# EAGLE board Inferno v1 (EAGLE 5.10), part 1 of 3
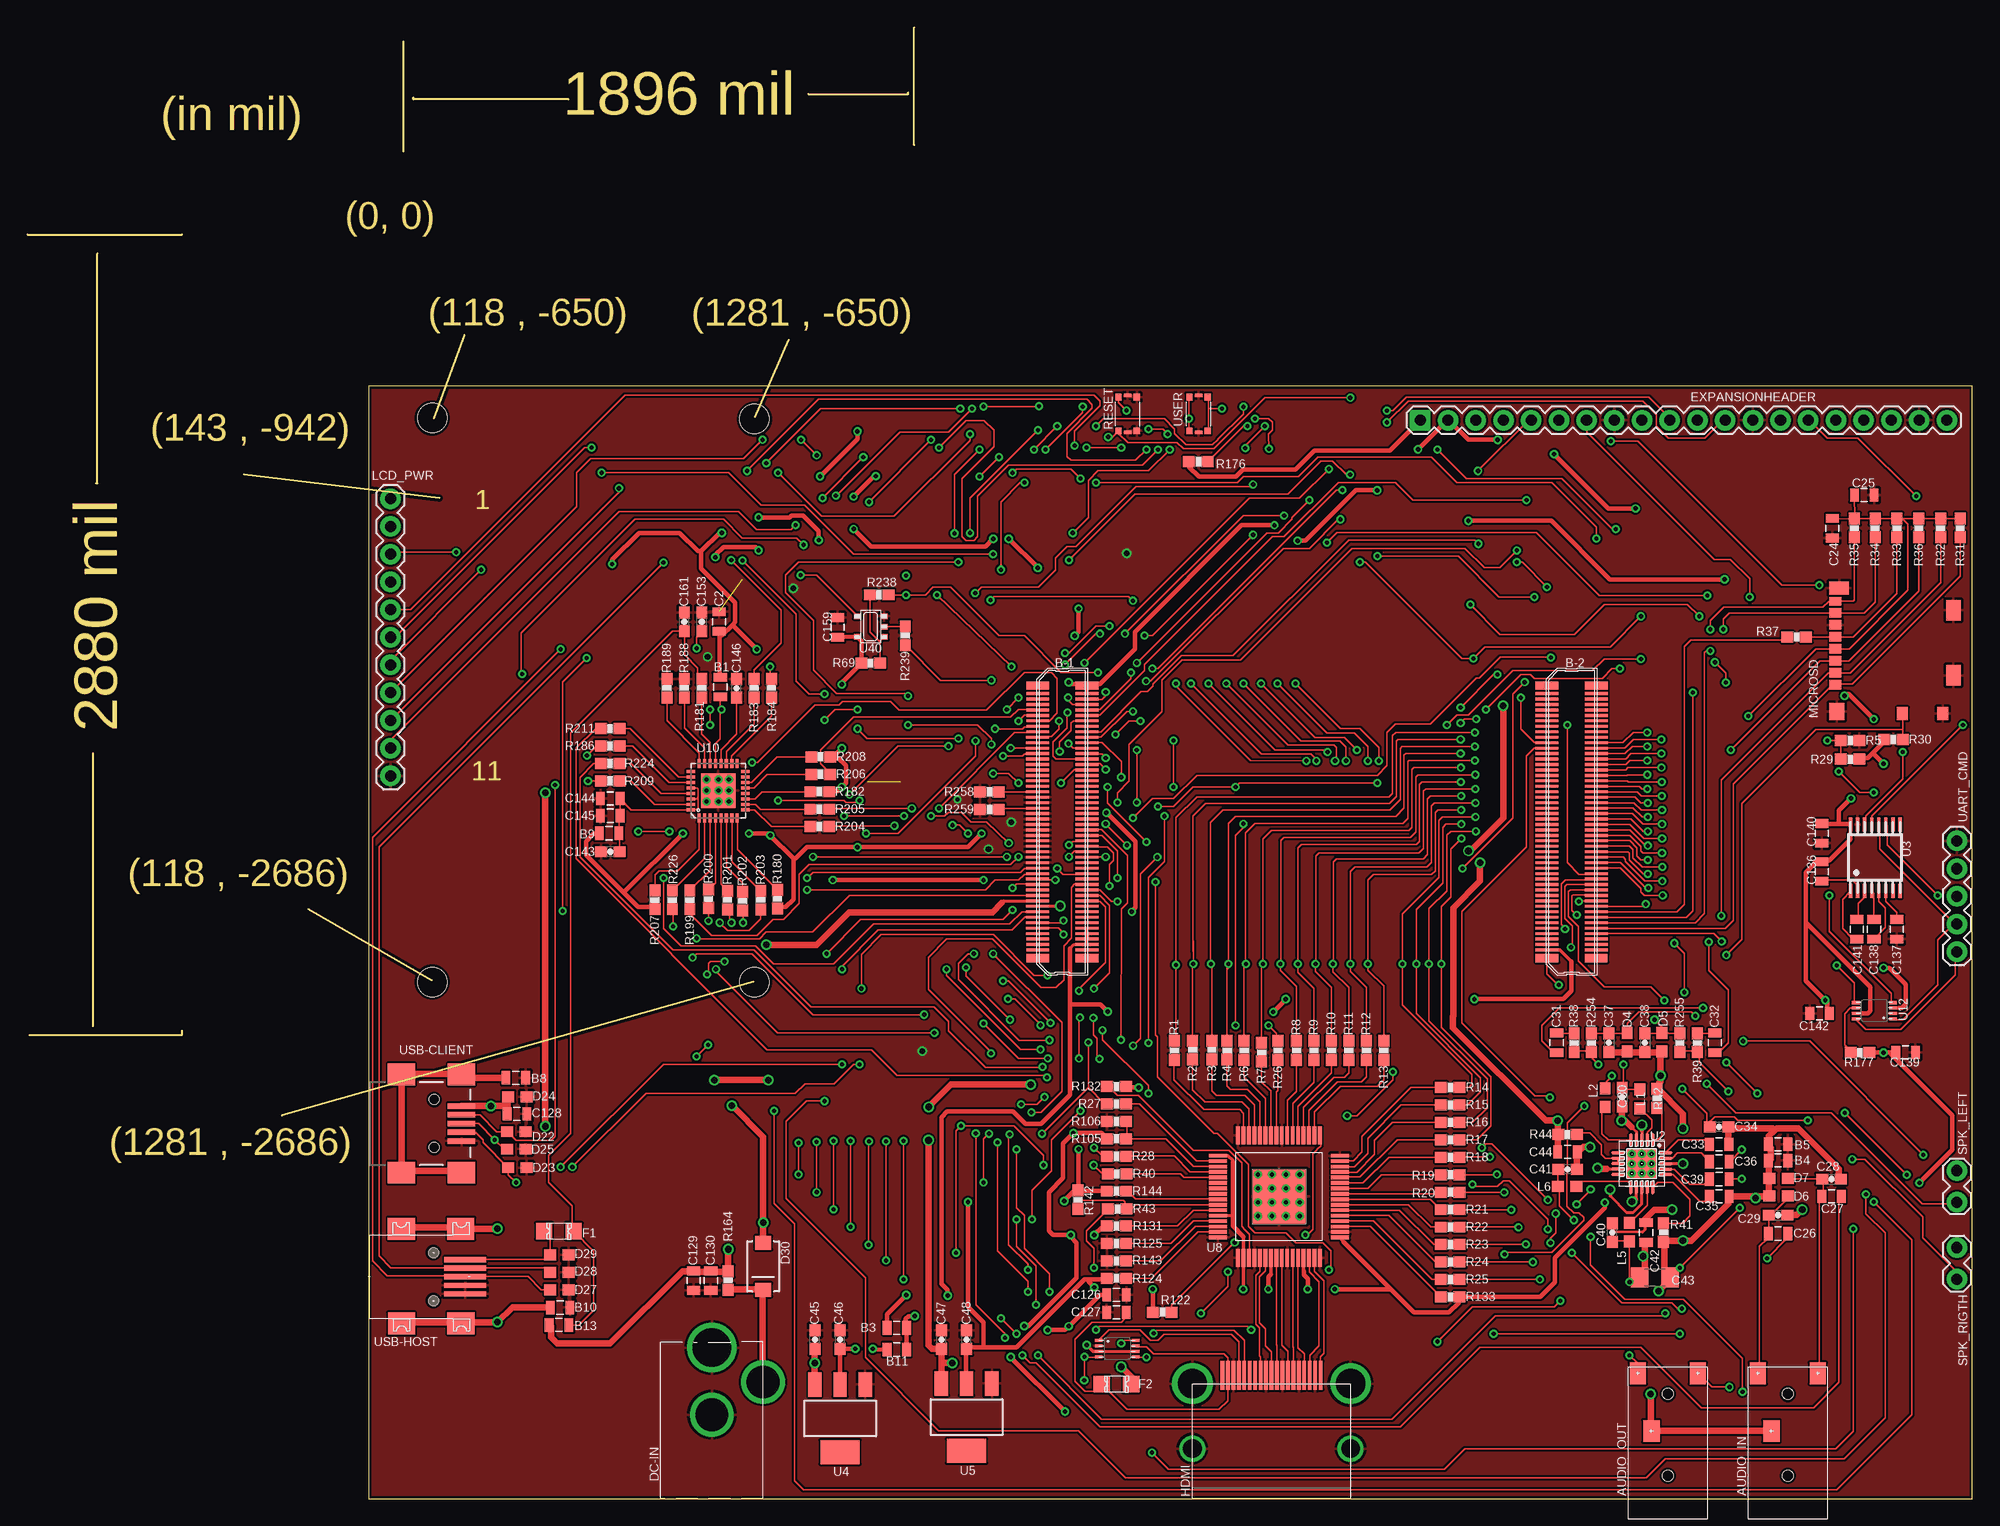
[diagram p7: board, top side]
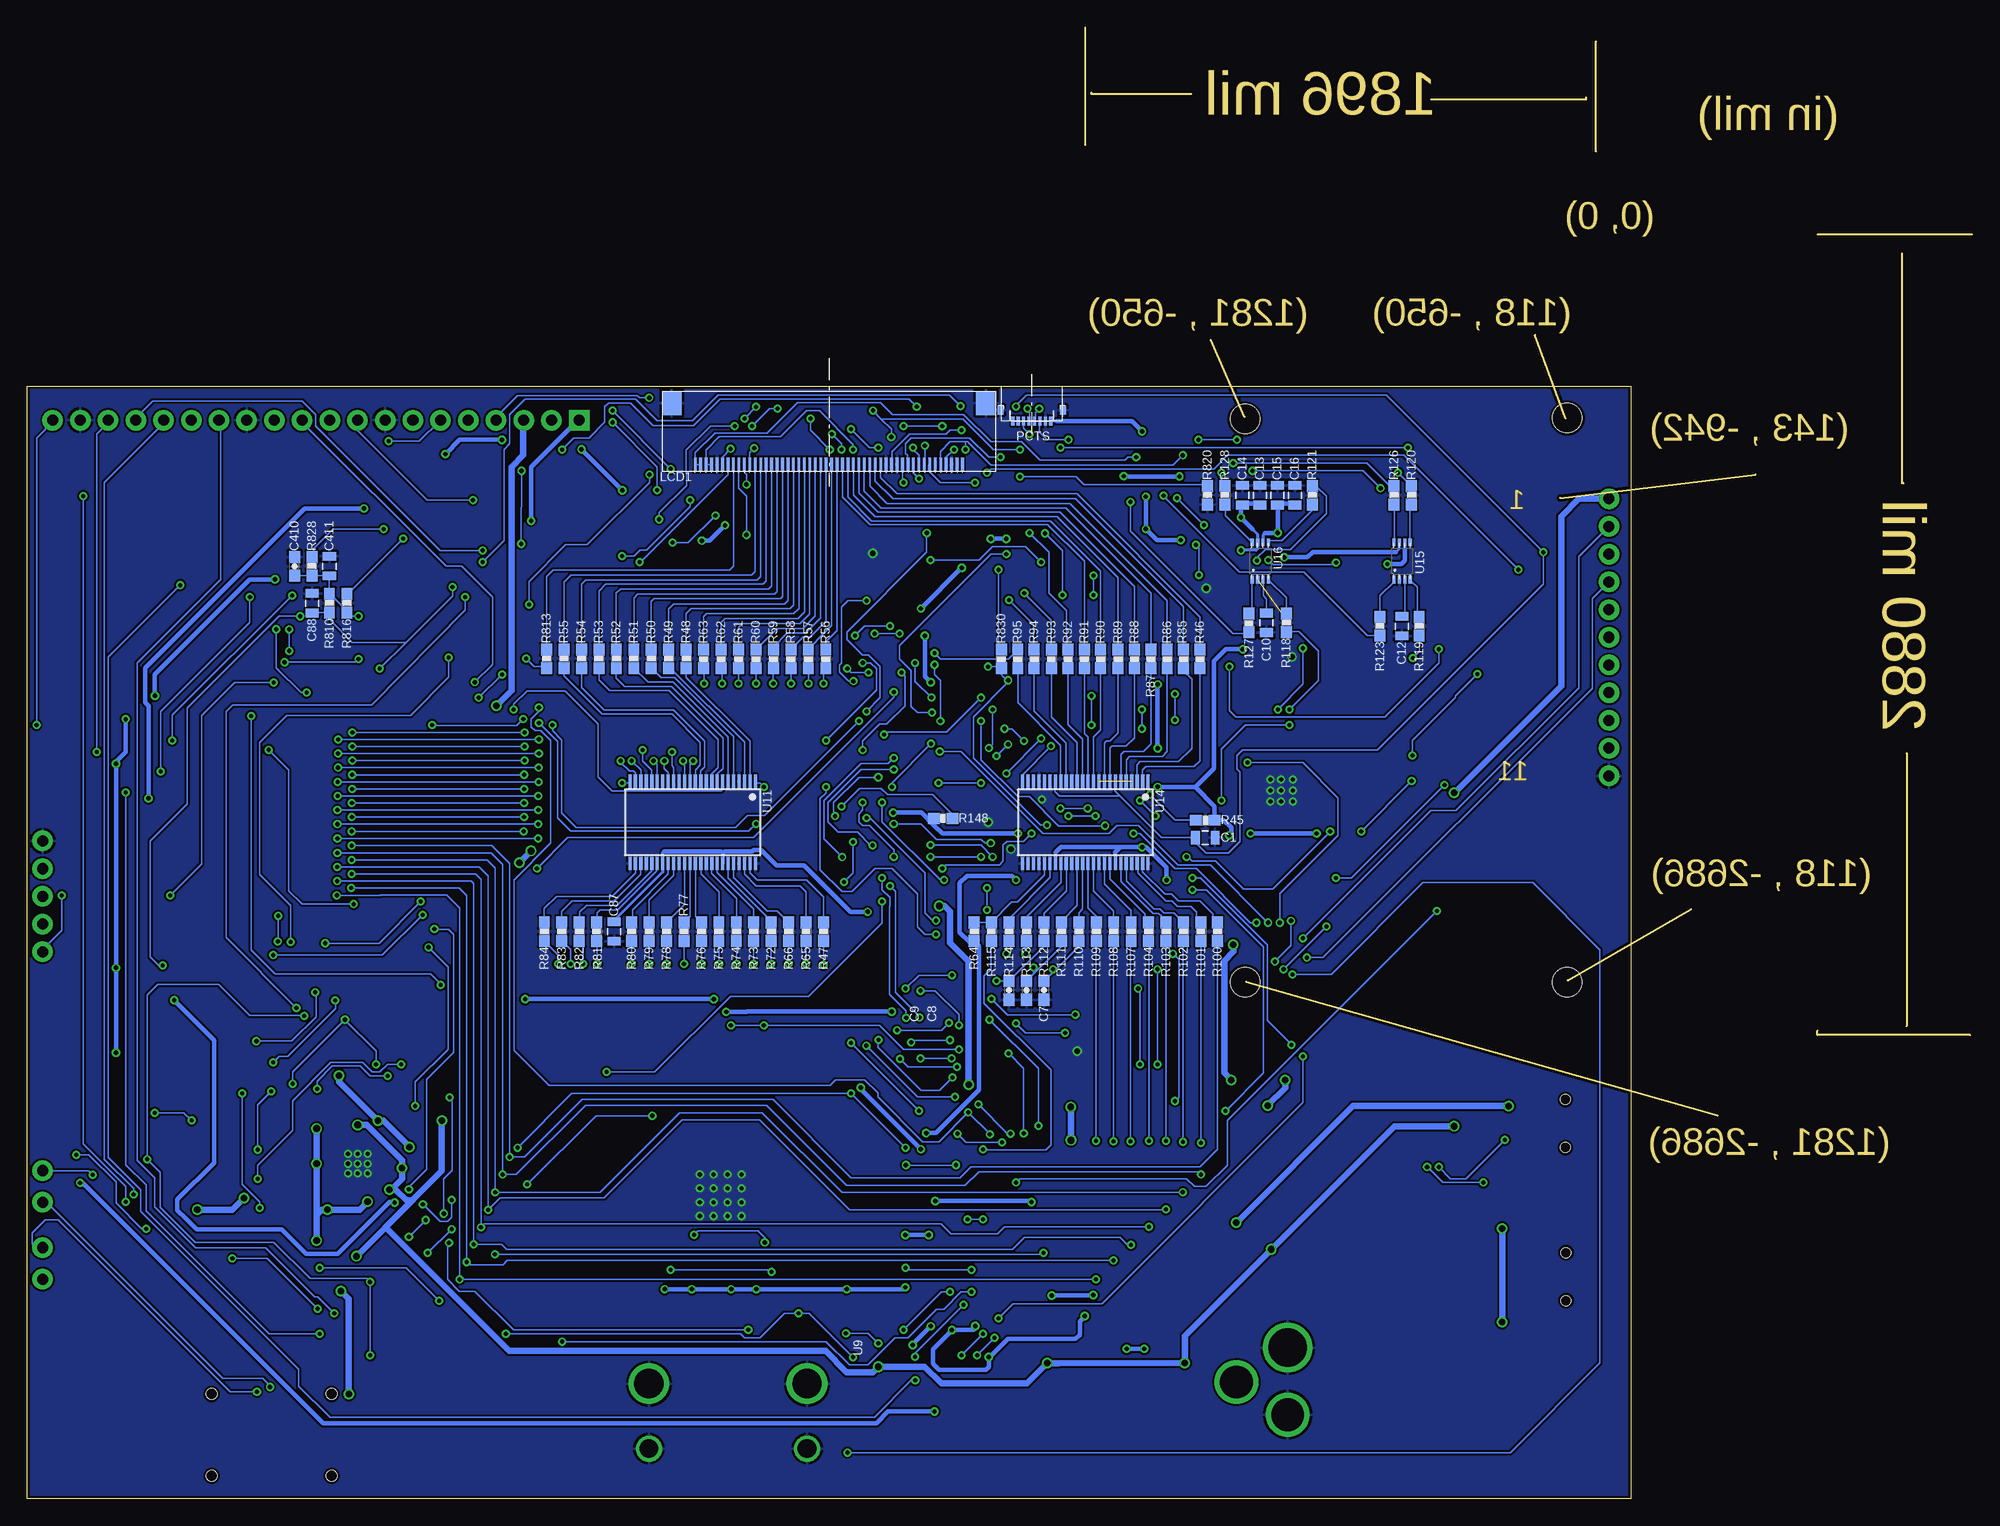
[diagram p8: board, bottom side, seen from below]

Size 178.3 x 134.9 mm. Coordinates in mm from the lower left corner, seen from the top.
Outline: 0.2,42.5 14.2,42.5 14.2,42.9
Outline: 0,115.9 14.2,115.9
Outline: 34.5,123.5 34.5,133.6
Outline: 81.3,124.1 81.3,134.9
Outline: 71.61,128.78 80.75,128.78 80.75,128.93
Outline: 49.61,128.29 35.39,128.29 35.39,128.45
Outline: 6.28,93.09 6.43,93.09 6.43,114.15
Outline: 6,68.35 6,43.33
Outline: 37.29,99.06 40.09,106.68
Outline: 66.71,99.16 69.81,106.22
Outline: 37.09,47.52 25.79,54.03
Outline: 66.56,47.4 23.32,35.13
Outline: 37.78,91.75 19.84,93.9
Outline: 31.3,0 178.3,0 178.3,102 31.3,102 31.3,0
Copper layers (1*16): Top 0.035mm / dielectric 1.5mm / Bottom 0.035mm
Design rules "alteio_4pcb.com_2010_2drc": minimum track width 6mil, minimum drill 15mil, track to track 7mil, track to pad 7mil, pad to pad 7mil, via to via 7mil, smd to smd 7mil, copper to edge 10mil, drill to drill 7mil, minimum pad ring 7mil, minimum via ring 7mil, stop-mask expansion 3mil, vias tented up to drill 0mil, thermal gap 10mil
Net classes: 0 net_DATA: width 0.152 mm, drill 0.381 mm; 1 net_DC_5V: width 0.61 mm, drill 0.61 mm; 2 net_MAIN_DC: width 0.61 mm, drill 0.61 mm; 3 net_VIO_1V8: width 0.406 mm, drill 0.406 mm; 4 net_+3.3V: width 0.406 mm, drill 0.406 mm; 5 net_GND: width 0.61 mm, drill 0.508 mm; 6 net_A_GND: width 0.61 mm, drill 0.508 mm; 7 net_USBC1_GND: width 0.61 mm, drill 0.508 mm

## Footprints (pad centres in the part's own frame; a part is rotated, then mirrored left to right if it is on the bottom)
AUDIO-JACK = smd 2 x 1.5: 1 0.963,1.405; 2 6.263,-2.845; 3 6.263,2.655 | hole 1: -3.137,-0.095; 4.363,-0.095
0805 = smd 0.8 x 1.25: 1 -0.9,0; 2 0.9,0
AXK-SOCKET = smd 2.1 x 0.75: A1 -2.49,12.63; A50 -2.49,-12.37; B1 2.015,12.63; B50 2.01,-12.37 | smd 2.1 x 0.25: A2 -2.49,11.88; A3 -2.49,11.38; A4 -2.49,10.88; A5 -2.49,10.38; A6 -2.49,9.88; A7 -2.49,9.38; A8 -2.49,8.88; A9 -2.49,8.38; A10 -2.495,7.88; A11 -2.495,7.38; A12 -2.495,6.88; A13 -2.495,6.38; A14 -2.495,5.88; A15 -2.495,5.38; A16 -2.495,4.88; A17 -2.495,4.38; A18 -2.495,3.88; A19 -2.495,3.38; A20 -2.495,2.88; A21 -2.495,2.38; A22 -2.495,1.88; A23 -2.495,1.38; A24 -2.495,0.88; A25 -2.495,0.38; A26 -2.5,-0.12; A27 -2.5,-0.62; A28 -2.5,-1.12; A29 -2.5,-1.62; A30 -2.5,-2.12; A31 -2.5,-2.62; A32 -2.5,-3.12; A33 -2.5,-3.62; A34 -2.5,-4.12; A35 -2.495,-4.62; A36 -2.495,-5.12; A37 -2.495,-5.62; A38 -2.495,-6.12; A39 -2.495,-6.62; A40 -2.495,-7.12; A41 -2.495,-7.62; A42 -2.5,-8.12; A43 -2.5,-8.62; A44 -2.5,-9.12; A45 -2.5,-9.62; A46 -2.5,-10.12; A47 -2.49,-10.62; A48 -2.49,-11.12; A49 -2.49,-11.62; B2 2.015,11.88; B3 2.015,11.38; B4 2.015,10.88; B5 2.025,10.38; B6 2.025,9.88; B7 2.025,9.38; B8 2.025,8.88; B9 2.025,8.38; B10 2.02,7.88; B11 2.02,7.38; B12 2.02,6.88; B13 2.02,6.38; B14 2.02,5.88; B15 2.02,5.38; B16 2.02,4.88; B17 2.025,4.38; B18 2.025,3.88; B19 2.025,3.38; B20 2.025,2.88; B21 2.025,2.38; B22 2.025,1.88; B23 2.025,1.38; B24 2.025,0.88; B25 2.025,0.38; B26 2.02,-0.12; B27 2.02,-0.62; B28 2.02,-1.12; B29 2.02,-1.62; B30 2.02,-2.12; B31 2.02,-2.62; B32 2.02,-3.12; B33 2.02,-3.62; B34 2.02,-4.12; B35 2.02,-4.62; B36 2.02,-5.12; B37 2.02,-5.62; B38 2.02,-6.12; B39 2.02,-6.62; B40 2.02,-7.12; B41 2.015,-7.62; B42 2.015,-8.12; B43 2.015,-8.62; B44 2.015,-9.12; B45 2.015,-9.62; B46 2.015,-10.12; B47 2.015,-10.62; B48 2.015,-11.12; B49 2.015,-11.62
0805' = smd 0.8 x 1.2: 1 -0.9,0; 2 0.9,0
0603-CAP = smd 1.1 x 1: 1 -0.85,0; 2 0.85,0
1206 = smd 1.6 x 1.8: 1 -1.4,0; 2 1.4,0
0603 = smd 1.1 x 1: 1 -0.796,-0.043; 2 0.904,-0.043
SMA-DIODE@1 = smd 1.27 x 1.47: A -2.15,0; C 2.15,0
KLDX_0202 = drill 3 round: DCIN 3,-4.7; GND 0,0 | drill 3.5 round: GND_BRK 6.15,0
1X20 = drill 1.016 pad 1.88 square: 1 0,0 | drill 1.016 pad 1.88 round: 2 2.54,0; 3 5.08,0; 4 7.62,0; 5 10.16,0; 6 12.7,0; 7 15.24,0; 8 17.78,0; 9 20.32,0; 10 22.86,0; 11 25.4,0; 12 27.94,0; 13 30.48,0; 14 33.02,0; 15 35.56,0; 16 38.1,0; 17 40.64,0; 18 43.18,0; 19 45.72,0; 20 48.26,0
SMD0805-100 = smd 1.5 x 1.5: IN -1.237,-0.115; OUT 1.463,-0.115
HDMI-19 = smd 0.35 x 2.65: 1 11.75,10.31; 2 11.25,10.31; 3 10.75,10.31; 4 10.25,10.31; 5 9.75,10.31; 6 9.25,10.31; 7 8.75,10.31; 8 8.24,10.31; 9 7.75,10.31; 10 7.25,10.31; 11 6.75,10.31; 12 6.25,10.31; 13 5.75,10.31; 14 5.25,10.31; 15 4.75,10.31; 16 4.25,10.31; 17 3.75,10.31; 18 3.25,10.31; 19 2.75,10.31 | drill 1.7 pad 2.3 round: MNT1 0,3.59; MNT4 14.5,3.59 | drill 2.7 pad 3.3 round: MNT2 0,9.55; MNT3 14.5,9.55
50PINS-FFC/FPC-CONNECTOR = smd 0.25 x 1.3: AVDD 8.734,-3.854; B0 -3.266,-3.854; B1 -3.766,-3.854; B2 -4.266,-3.854; B3 -4.766,-3.854; B4 -5.266,-3.854; B5 -5.766,-3.854; B6 -6.266,-3.854; B7 -6.766,-3.854; DCLK 5.734,-3.854; DE -8.266,-3.854; DITHB 10.734,-3.854; DVDD -9.266,-3.854; G0 0.734,-3.854; G1 0.234,-3.854; G2 -0.266,-3.854; G3 -0.766,-3.854; G4 -1.266,-3.854; G5 -1.766,-3.854; G6 -2.266,-3.854; G7 -2.766,-3.854; GND -10.266,-3.854; GND1 5.234,-3.854; GND2 6.234,-3.854; GND3 11.234,-3.854; HS -7.266,-3.854; L/R 6.734,-3.854; MODE/DE -8.766,-3.854; NC 9.734,-3.854; NC1 11.734,-3.854; NC2 12.234,-3.854; R0 4.734,-3.854; R1 4.234,-3.854; R2 3.734,-3.854; R3 3.234,-3.854; R4 2.734,-3.854; R5 2.234,-3.854; R6 1.734,-3.854; R7 1.234,-3.854; RESET 9.234,-3.854; U/D 7.234,-3.854; VCOM -9.766,-3.854; VCOM1 10.234,-3.854; VGH 7.734,-3.854; VGL 8.234,-3.854; VLED1+ -11.766,-3.854; VLED1- -10.766,-3.854; VLED+ -12.266,-3.854; VLED- -11.266,-3.854; VS -7.766,-3.854 | smd 1.8 x 2.2: GND4 14.384,1.796; GND5 -14.416,1.796
1X11 = drill 1.016 pad 1.88 round: 1 0,0; 2 2.54,0; 3 5.08,0; 4 7.62,0; 5 10.16,0; 6 12.7,0; 7 15.24,0; 8 17.78,0; 9 20.32,0; 10 22.86,0; 11 25.4,0
MOLEX_MICROSD@1 = smd 0.85 x 1.1: 1 8.08,0.55; 2 6.98,0.55; 3 5.88,0.55; 4 4.78,0.55; 5 3.68,0.55; 6 2.58,0.55; 7 1.48,0.55 | smd 0.75 x 1.1: 8 0.43,0.55 | smd 1.2 x 1: CD 10.715,6.7; CD_G 10.715,10.4 | smd 1.55 x 1.35: G1 10.54,0.675 | smd 1.17 x 1.8: G2 -0.78,0.9 | smd 1.9 x 1.35: G3 1.245,11.375; G4 7.215,11.375
FPC_CONNECTOR = smd 0.3 x 0.8: 1 -1.743,1.448; 2 -1.243,1.448; 3 -0.743,1.448; 4 -0.243,1.448; 5 0.257,1.448; 6 0.757,1.448; 7 1.257,1.448; 8 1.757,1.448 | smd 0.52 x 0.8: GND1 2.867,0.448; GND2 -2.853,0.448
0603-RES = smd 1.1 x 1: 1 -0.85,0; 2 0.85,0
TACTILE-SW = smd 0.625 x 0.575: 1 0,0; 2 0,-1.675; 3 3.1,0; 4 3.1,-1.675 | smd 0.325 x 0.7: 5 -0.15,-0.838; 6 3.25,-0.838
1X02_LOCK = drill 1.016 pad 1.88 round: 1 -0.178,0; 2 2.718,0
RTJ = smd 0.29 x 1.3: AGND -0.013,2.192; AVDD 0.477,-2.168; INL+ -1.013,2.182; INL- -0.513,2.192; INR+ 0.987,2.192; INR- 0.487,2.192; NC -1.023,-2.178; NC1 0.977,-2.178; SDL -0.523,-2.178; SDR -0.023,-2.168 | smd 2.7 x 2.7: EP -0.025,0 | smd 1.3 x 0.29: G0 2.157,1.002; G1 -2.203,1.012; OUTL+ -2.203,0.512; OUTL- -2.193,-0.988; OUTR+ 2.157,0.502; OUTR- 2.157,-0.998; PGND -2.203,-0.488; PGND1 2.157,-0.498; PVDD -2.203,0.012; PVDD1 2.167,0.002
TSSOP = smd 0.3 x 1.3: C1+ -2.366,-3.081; C1- -1.066,-3.081; C2+ -0.416,-3.081; C2- 0.234,-3.081; GND -1.716,3.019; R1_IN -0.416,3.019; R1_OUT 0.234,3.019; R2_IN 2.184,-3.081; R2_OUT 2.184,3.019; T1_IN 0.884,3.019; T1_OUT -1.066,3.019; T2_IN 1.534,3.019; T2_OUT 1.534,-3.081; V+ -1.716,-3.081; V- 0.884,-3.081; VCC -2.366,3.019
SOT223 = smd 1.219 x 2.235: 1 -2.311,-3.099; 2 0,-3.099; 3 2.311,-3.099 | smd 3.6 x 2.2: 4 0,3.099
S-PQFP-G64 = smd 1.65 x 0.35: 1 -5.6,3.75; 2 -5.6,3.25; 3 -5.6,2.75; 4 -5.6,2.25; 5 -5.6,1.75; 6 -5.6,1.25; 7 -5.6,0.75; 8 -5.6,0.25; 9 -5.6,-0.25; 10 -5.6,-0.75; 11 -5.6,-1.25; 12 -5.6,-1.75; 13 -5.6,-2.25; 14 -5.6,-2.75; 15 -5.6,-3.25; 16 -5.6,-3.75; 33 5.6,-3.75; 34 5.6,-3.25; 35 5.6,-2.75; 36 5.6,-2.25; 37 5.6,-1.75; 38 5.6,-1.25; 39 5.6,-0.75; 40 5.6,-0.25; 41 5.6,0.25; 42 5.6,0.75; 43 5.6,1.25; 44 5.6,1.75; 45 5.6,2.25; 46 5.6,2.75; 47 5.6,3.25; 48 5.6,3.75 | smd 0.35 x 1.65: 17 -3.75,-5.6; 18 -3.25,-5.6; 19 -2.75,-5.6; 20 -2.25,-5.6; 21 -1.75,-5.6; 22 -1.25,-5.6; 23 -0.75,-5.6; 24 -0.25,-5.6; 25 0.25,-5.6; 26 0.75,-5.6; 27 1.25,-5.6; 28 1.75,-5.6; 29 2.25,-5.6; 30 2.75,-5.6; 31 3.25,-5.6; 32 3.75,-5.6; 49 3.75,5.6; 50 3.25,5.6; 51 2.75,5.6; 52 2.25,5.6; 53 1.75,5.6; 54 1.25,5.6; 55 0.75,5.6; 56 0.25,5.6; 57 -0.25,5.6; 58 -0.75,5.6; 59 -1.25,5.6; 60 -1.75,5.6; 61 -2.25,5.6; 62 -2.75,5.6; 63 -3.25,5.6; 64 -3.75,5.6 | smd 5 x 5: EP 0,0
DCU = smd 0.3 x 0.7: A1 0.785,1.668; A2 0.785,-1.732; B1 -0.715,1.668; B2 -0.715,-1.732; GND -0.215,-1.732; OE 0.285,1.668; V_CCA 0.285,-1.732; V_CCB -0.215,1.668
QFN-32 = smd 0.285 x 0.8: 1 -1.75,-2.5; 2 -1.25,-2.5; 3 -0.75,-2.5; 4 -0.25,-2.5; 5 0.25,-2.5; 6 0.75,-2.5; 7 1.25,-2.5; 8 1.75,-2.5; 17 1.75,2.5; 18 1.25,2.5; 19 0.75,2.5; 20 0.25,2.5; 21 -0.25,2.5; 22 -0.75,2.5; 23 -1.25,2.5; 24 -1.75,2.5 | smd 0.8 x 0.285: 9 2.5,-1.75; 10 2.5,-1.25; 11 2.5,-0.75; 12 2.5,-0.25; 13 2.5,0.25; 14 2.5,0.75; 15 2.5,1.25; 16 2.5,1.75; 25 -2.5,1.75; 26 -2.5,1.25; 27 -2.5,0.75; 28 -2.5,0.25; 29 -2.5,-0.25; 30 -2.5,-0.75; 31 -2.5,-1.25; 32 -2.5,-1.75 | smd 3.15 x 3.15: EP 0,0
TSSOP48 = smd 0.29 x 1.2: 1 -5.75,-3.775; 2 -5.25,-3.775; 3 -4.75,-3.775; 4 -4.25,-3.775; 5 -3.75,-3.775; 6 -3.25,-3.775; 7 -2.75,-3.775; 8 -2.25,-3.775; 9 -1.75,-3.775; 10 -1.25,-3.775; 11 -0.75,-3.775; 12 -0.25,-3.775; 13 0.25,-3.775; 14 0.75,-3.775; 15 1.25,-3.775; 16 1.75,-3.775; 17 2.25,-3.775; 18 2.75,-3.775; 19 3.25,-3.775; 20 3.75,-3.775; 21 4.25,-3.775; 22 4.75,-3.775; 23 5.25,-3.775; 24 5.75,-3.775; 25 5.75,3.775; 26 5.25,3.775; 27 4.75,3.775; 28 4.25,3.775; 29 3.75,3.775; 30 3.25,3.775; 31 2.75,3.775; 32 2.25,3.775; 33 1.75,3.775; 34 1.25,3.775; 35 0.75,3.775; 36 0.25,3.775; 37 -0.25,3.775; 38 -0.75,3.775; 39 -1.25,3.775; 40 -1.75,3.775; 41 -2.25,3.775; 42 -2.75,3.775; 43 -3.25,3.775; 44 -3.75,3.775; 45 -4.25,3.775; 46 -4.75,3.775; 47 -5.25,3.775; 48 -5.75,3.775
SOT-23-DBV = smd 0.5 x 0.65: A -0.949,-1.211; B 0.001,-1.211; GND 0.951,-1.211; VCC -0.949,1.239; Y 0.951,1.239
STANDOFF_2.8MM = hole 2.7: 0,0
1X05 = drill 1.016 pad 1.88 round: 1 0,0; 2 2.54,0; 3 5.08,0; 4 7.62,0; 5 10.16,0
USB-MINIB = smd 2.5 x 0.5: D+ 2.5,0; D- 2.5,0.8; GND 2.5,-1.6; ID 2.5,-0.8; VBUS 2.5,1.6 | smd 2.5 x 2: MTN1 -3,4.5; MTN2 2.5,4.5; MTN3 -3,-4.5; MTN4 2.5,-4.5 | hole 0.9: 0,2.2; 0,-2.2
MINI-USB-A = smd 3.81 x 0.483: D+ -4.089,0.013; D- -4.089,-0.775; GND -4.089,0.8; GND1 -4.089,1.587; V_AUX -4.089,-1.562 | smd 2.489 x 2.007: GND2 -3.696,4.28; GND3 1.74,4.293; GND4 1.753,-4.381; GND5 -3.683,-4.381 | hole 0.914: -1.194,-2.184; -1.194,2.21

## Placement (x,y rotation side)
AUDIO_IN  [AUDIO-JACK]  161.3,5.24 90 top
AUDIO_OUT  [AUDIO-JACK]  150.3,5.24 90 top
B1  BEAD-0603  [0805]  63.54,74.41 270 top
B3  BEAD-0603  [0805]  79.71,15.67 180 top
B4  BEAD-0603  [0805]  160.5,31 0 top
B5  BEAD-0603  [0805]  160.5,32.5 0 top
B8  BEAD-0603  [0805]  44.79,38.59 0 top
B9  BEAD-0603  [0805]  53.34,61.01 0 top
B10  BEAD-0603  [0805]  48.84,17.52 180 top
B11  BEAD-0603  [0805]  79.71,13.67 180 top
B13  BEAD-0603  [0805]  48.74,15.92 0 top
B-1  [AXK-SOCKET]  95.12,61.93 0 top
B-2  [AXK-SOCKET]  141.81,61.93 0 top
C1  0.1u/16V  [0805']  70.3,60.6 0 bottom
C2  0.1u/16V  [0805']  63.44,80.41 90 top
C7  150pF  [0603-CAP]  85.1,46.6 270 bottom
C8  150pF  [0603-CAP]  86.7,46.6 270 bottom
C9  150pF  [0603-CAP]  88.3,46.6 270 bottom
C10  0.1u/10V  [0805']  64.7,80.3 270 bottom
C12  0.1u/16V  [0805']  52.3,80 270 bottom
C13  0.1u/16V  [0805']  65.3,92 90 bottom
C14  0.1u/16V  [0805']  66.9,92 90 bottom
C15  0.1u/16V  [0805']  63.7,92 90 bottom
C16  0.1u/16V  [0805']  62.1,92 90 bottom
C24  10u/10V  [0805']  165.49,88.97 270 top
C25  0.1u/16V  [0805']  168.4,92 0 top
C26  0.1u/16V  [0805']  160.5,24.3 0 top
C27  0.1u/16V  [0805']  165.4,27.7 0 top
C28  47p  [0603-CAP]  165.4,29.3 0 top
C29  47p  [0603-CAP]  160.5,26 0 top
C30  1000p  [0603-CAP]  146.2,36.8 270 top
C31  47u/10V  [0805']  140.2,41.8 90 top
C32  47u/10V  [0805']  154.7,41.8 90 top
C33  0.1u/16V  [0805']  155.09,32.48 0 top
C34  1000p  [0603-CAP]  155.1,34.1 180 top
C35  0.1u/16V  [0805']  155.1,27.7 0 top
C36  0.1u/16V  [0805']  155.1,30.9 0 top
C37  47p  [0603-CAP]  145,41.8 270 top
C38  47p  [0603-CAP]  148.3,41.8 270 top
C39  0.1u/16V  [0805']  155.1,29.3 0 top
C40  1000p  [0603-CAP]  145.3,24.4 90 top
C41  1000p  [0603-CAP]  141.2,30.2 180 top
C42  0.1u/16V  [0805']  148.4,24.4 90 top
C43  4.7u/25V  [1206]  149.2,20.3 0 top
C44  1u/25V  [0805']  141.2,31.8 0 top
C45  1000n  [0603-CAP]  72.21,14.57 90 top
C46  10u  [0603-CAP]  74.51,14.57 90 top
C47  1000n  [0603-CAP]  83.81,14.57 90 top
C48  10u  [0603-CAP]  86.11,14.57 90 top
C87  0.1u/16V  [0805']  124.5,52 270 bottom
C88  0.1u/16V  [0805']  152.2,82.1 90 bottom
C126  0.1u/16V  [0805']  99.85,18.7 0 top
C127  0.1u/16V  [0805']  99.85,17.1 180 top
C128  0.1u/16V  [0805']  44.89,35.29 0 top
C129  10u/10V  [0805']  61.08,20 270 top
C130  0.1u/16V  [0805']  62.66,20 270 top
C136  0.1u/16V  [0805']  164.5,57.5 270 top
C137  0.1u/16V  [0805']  171.4,52.2 270 top
C138  0.1u/16V  [0805']  169.3,52.2 270 top
C139  0.1u/16V  [0805']  172.2,40.9 0 top
C140  0.1u/16V  [0805']  164.5,61 270 top
C141  0.1u/16V  [0805']  167.7,52.2 90 top
C142  0.1u/16V  [0805']  164.3,44.5 180 top
C143  10u/10V  [0603-CAP]  53.44,59.31 180 top
C144  0.1u/16V  [0805']  53.44,64.21 180 top
C145  0.1u/16V  [0805']  53.44,62.61 180 top
C146  2.2u/16V  [0603-CAP]  65.04,74.31 90 top
C153  10u/10V  [0603-CAP]  61.84,80.41 90 top
C159  0.1u/16V  [0805']  74.29,79.88 90 top
C161  10u/10V  [0603-CAP]  60.24,80.41 90 top
C410  10u/10V  [0603-CAP]  153.8,85.5 90 bottom
C411  0.1u/16V  [0805']  150.6,85.5 90 bottom
D4  DIODES  [0603]  146.7,41.9 270 top
D5  DIODES  [0603]  149.9,41.9 270 top
D6  DIODES  [0603]  160.5,27.8 0 top
D7  DIODES  [0603]  160.5,29.4 0 top
D22  DIODES  [0603]  44.79,33.69 0 top
D23  DIODES  [0603]  44.89,30.39 0 top
D24  DIODES  [0603]  44.89,36.89 0 top
D25  DIODES  [0603]  44.79,32.09 0 top
D27  DIODES  [0603]  48.84,19.12 180 top
D28  DIODES  [0603]  48.84,20.72 180 top
D29  DIODES  [0603]  48.84,22.32 180 top
D30  40V/2A  [SMA-DIODE@1]  67.46,21.3 270 top
DC-IN  KLDX_0202  [KLDX_0202]  62.76,7.7 90 top
EXPANSIONHEADER  M20  [1X20]  127.71,98.88 0 top
F1  0805L100WR  [SMD0805-100]  48.84,24.42 180 top
F2  0805L100WR  [SMD0805-100]  99.95,10.4 180 top
HDMI  HDMI-19  [HDMI-19]  106.81,1 0 top
L1  70/4A  [0603]  147.8,36.6 90 top
L2  70/4A  [0603]  144.6,36.7 90 top
L5  70/4A  [0603]  146.9,24.5 270 top
L6  70/4A  [0603]  141.2,28.6 180 top
LCD1  MWFPC05P-H20C  [50PINS-FFC/FPC-CONNECTOR]  104.8,98.66 0 bottom
LCD_PWR  M11PTH  [1X11]  33.3,91.67 270 top
MICROSD  MICRO-SD-MOLEX  [MOLEX_MICROSD@1]  165.2,82.69 270 top
PCTS  0810-EDLF  [FPC_CONNECTOR]  86.21,100.25 180 bottom
R1  10  [0603-RES]  105.15,41.1 270 top
R2  10  [0603-RES]  106.83,41.14 270 top
R3  10  [0603-RES]  108.61,41.14 270 top
R4  10  [0603-RES]  109.99,41.12 270 top
R5  10k  [0603-RES]  167.1,69.5 180 top
R6  10  [0603-RES]  111.55,41.1 270 top
R7  10  [0603-RES]  113.15,40.92 270 top
R8  10  [0603-RES]  116.35,41.1 270 top
R9  10  [0603-RES]  117.95,41.1 270 top
R10  10  [0603-RES]  119.55,41.1 270 top
R11  10  [0603-RES]  121.15,41.1 270 top
R12  10  [0603-RES]  122.75,41.1 270 top
R13  10  [0603-RES]  124.35,41.1 270 top
R14  10  [0603-RES]  130.45,37.7 180 top
R15  10  [0603-RES]  130.45,36.1 180 top
R16  10  [0603-RES]  130.45,34.5 180 top
R17  10  [0603-RES]  130.45,32.9 180 top
R18  10  [0603-RES]  130.45,31.3 180 top
R19  10  [0603-RES]  130.45,29.7 180 top
R20  10  [0603-RES]  130.45,28.1 180 top
R21  10  [0603-RES]  130.45,26.5 180 top
R22  10  [0603-RES]  130.45,24.9 180 top
R23  10  [0603-RES]  130.45,23.3 180 top
R24  10  [0603-RES]  130.45,21.7 180 top
R25  10  [0603-RES]  130.45,20.1 180 top
R26  10  [0603-RES]  114.65,41.1 270 top
R27  10  [0603-RES]  99.85,36.2 0 top
R28  10  [0603-RES]  99.85,31.4 0 top
R29  10k  [0603-RES]  167.1,67.8 0 top
R30  10k  [0603-RES]  171.07,69.59 180 top
R31  10k  [0603-RES]  177.2,89 90 top
R32  10k  [0603-RES]  175.4,89 90 top
R33  10k  [0603-RES]  171.4,89 90 top
R34  10k  [0603-RES]  169.4,89 90 top
R35  10k  [0603-RES]  167.5,89 90 top
R36  10k  [0603-RES]  173.4,89 90 top
R37  33  [0603-RES]  162.2,79 180 top
R38  33  [0603-RES]  141.8,41.8 270 top
R39  33  [0603-RES]  153.1,41.8 270 top
R40  10  [0603-RES]  99.91,29.78 0 top
R41  0  [0603-RES]  150,24.4 270 top
R42  0  [0603-RES]  149.4,36.7 270 top
R43  10  [0603-RES]  99.93,26.56 0 top
R44  120k  [0603-RES]  141.2,33.4 0 top
R45  10k  [0603-RES]  70.3,62.2 0 bottom
R46  22  [0603-RES]  70.8,77 270 bottom
R47  22  [0603-RES]  105.3,52 270 bottom
R48  22  [0603-RES]  117.9,77.02 270 bottom
R49  22  [0603-RES]  119.5,77.02 270 bottom
R50  22  [0603-RES]  121.1,77.02 270 bottom
R51  22  [0603-RES]  122.7,77.02 270 bottom
R52  22  [0603-RES]  124.3,77.02 270 bottom
R53  22  [0603-RES]  125.9,77.02 270 bottom
R54  22  [0603-RES]  127.5,77.02 270 bottom
R55  22  [0603-RES]  129.1,77.02 270 bottom
R56  22  [0603-RES]  105.1,77 270 bottom
R57  22  [0603-RES]  106.7,77 270 bottom
R58  22  [0603-RES]  108.3,77 270 bottom
R59  22  [0603-RES]  109.9,77 270 bottom
R60  22  [0603-RES]  111.5,77 270 bottom
R61  22  [0603-RES]  113.1,77 270 bottom
R62  22  [0603-RES]  114.7,77 270 bottom
R63  22  [0603-RES]  116.3,77 270 bottom
R64  22  [0603-RES]  91.5,52 270 bottom
R65  22  [0603-RES]  106.9,52 270 bottom
R66  22  [0603-RES]  108.5,52 270 bottom
R69  4.7k  [0603-RES]  77.32,76.62 0 top
R72  22  [0603-RES]  110.1,52 270 bottom
R73  22  [0603-RES]  111.7,52 270 bottom
R74  22  [0603-RES]  113.3,52 270 bottom
R75  22  [0603-RES]  114.9,52 270 bottom
R76  22  [0603-RES]  116.5,52 270 bottom
R77  22  [0603-RES]  118.1,52 270 bottom
R78  22  [0603-RES]  119.7,52 270 bottom
R79  22  [0603-RES]  121.3,52 270 bottom
R80  22  [0603-RES]  122.9,52 270 bottom
R81  22  [0603-RES]  126.1,52 270 bottom
R82  22  [0603-RES]  127.7,52 270 bottom
R83  22  [0603-RES]  129.3,52 270 bottom
R84  22  [0603-RES]  130.9,52 270 bottom
R85  22  [0603-RES]  72.3,77 270 bottom
R86  22  [0603-RES]  73.8,77 270 bottom
R87  22  [0603-RES]  75.3,77 270 bottom
R88  22  [0603-RES]  76.8,77 270 bottom
R89  22  [0603-RES]  78.3,77 270 bottom
R90  22  [0603-RES]  79.9,77 270 bottom
R91  22  [0603-RES]  81.4,77 270 bottom
R92  22  [0603-RES]  82.9,77 270 bottom
R93  22  [0603-RES]  84.4,77 270 bottom
R94  22  [0603-RES]  86,77 270 bottom
R95  22  [0603-RES]  87.5,77 270 bottom
R100  22  [0603-RES]  69.2,52 270 bottom
R101  22  [0603-RES]  70.7,52 270 bottom
R102  22  [0603-RES]  72.3,52 270 bottom
R103  22  [0603-RES]  73.9,52 270 bottom
R104  22  [0603-RES]  75.5,52 270 bottom
R105  10k  [0603-RES]  99.85,33 180 top
R106  10K  [0603-RES]  99.85,34.6 0 top
R107  22  [0603-RES]  77.1,52 270 bottom
R108  22  [0603-RES]  78.7,52 270 bottom
R109  22  [0603-RES]  80.3,52 270 bottom
R110  22  [0603-RES]  81.9,52 270 bottom
R111  22  [0603-RES]  83.5,52 270 bottom
R112  22  [0603-RES]  85.1,52 270 bottom
R113  22  [0603-RES]  86.7,52 270 bottom
R114  22  [0603-RES]  88.3,52 270 bottom
R115  22  [0603-RES]  89.9,52 270 bottom
R118  10  [0603-RES]  62.88,80.31 270 bottom
R119  10  [0603-RES]  50.7,80 270 bottom
R120  10  [0603-RES]  51.4,92 270 bottom
R121  10  [0603-RES]  60.5,92 270 bottom
R122  4.7k  [0603-RES]  104.05,17.1 180 top
R123  10  [0603-RES]  54.29,80 90 bottom
R124  10k  [0603-RES]  99.85,20.2 180 top
R125  1k  [0603-RES]  99.85,23.4 180 top
R126  10  [0603-RES]  53,92 270 bottom
R127  5.6K  [0603-RES]  66.3,80.3 90 bottom
R128  10  [0603-RES]  68.5,92 270 bottom
R131  4.7k  [0603-RES]  99.85,25 180 top
R132  510  [0603-RES]  99.85,37.8 0 top
R133  1k  [0603-RES]  130.45,18.5 0 top
R142  10k  [0603-RES]  96.33,27.41 90 top
R143  10k  [0603-RES]  99.85,21.8 180 top
R144  10k  [0603-RES]  99.85,28.2 180 top
R148  10k  [0603-RES]  94.34,62.36 180 bottom
R164  0.1  [0603-RES]  64.26,20 90 top
R176  0  [0603-RES]  107.36,95.06 180 top
R177  10k  [0603-RES]  168,40.9 0 top
R180  0  [0603-RES]  68.78,54.97 90 top
R181  10k  [0603-RES]  61.84,74.31 90 top
R182  0  [0603-RES]  72.64,64.81 180 top
R183  0  [0603-RES]  66.64,74.31 90 top
R184  0  [0603-RES]  68.24,74.31 90 top
R186  0  [0603-RES]  53.44,69.01 0 top
R188  10k  [0603-RES]  60.24,74.31 90 top
R189  8.06k-1%  [0603-RES]  58.64,74.31 90 top
R199  0  [0603-RES]  60.74,54.91 90 top
R200  0  [0603-RES]  62.46,54.99 90 top
R201  0  [0603-RES]  64.2,54.89 90 top
R202  0  [0603-RES]  65.58,54.79 90 top
R203  0  [0603-RES]  67.24,54.89 90 top
R204  0  [0603-RES]  72.64,61.61 180 top
R205  0  [0603-RES]  72.64,63.21 180 top
R206  0  [0603-RES]  72.74,66.41 180 top
R207  10  [0603-RES]  57.54,54.91 90 top
R208  0  [0603-RES]  72.74,68.01 180 top
R209  0  [0603-RES]  53.44,65.81 0 top
R211  0  [0603-RES]  53.44,70.61 0 top
R224  0  [0603-RES]  53.44,67.41 0 top
R226  0  [0603-RES]  59.14,54.91 90 top
R238  0  [0603-RES]  78.09,82.87 180 top
R239  0  [0603-RES]  80.49,79.12 90 top
R254  0  [0603-RES]  143.4,41.8 90 top
R255  0  [0603-RES]  151.5,41.8 90 top
R258  0  [0603-RES]  88.2,64.8 0 top
R259  0  [0603-RES]  88.2,63.2 0 top
R810  0  [0603-RES]  150.6,82.1 270 bottom
R813  10k  [0603-RES]  130.7,77.02 270 bottom
R816  10K  [0603-RES]  149,82.1 90 bottom
R820  0  [0603-RES]  70.1,92 90 bottom
R828  10k  [0603-RES]  152.2,85.5 90 bottom
R830  0  [0603-RES]  89,77 90 bottom
RESET  BUTTON  [TACTILE-SW]  100.04,97.9 90 top
SPK_LEFT  LEFT_SPEAKER  [1X02_LOCK]  176.9,29.9 270 top
SPK_RIGTH  RIGTH_SPEAKER  [1X02_LOCK]  176.9,20.3 90 top
U2  TPA2012D2RTJR  [RTJ]  148,30.7 270 top
U3  ADM3202ARUZ  [TSSOP]  169.5,58.8 0 top
U4  LD1117S18TR  [SOT223]  74.51,7.37 180 top
U5  LD1117S33TR  [SOT223]  86.11,7.47 180 top
U8  TPF410  [S-PQFP-G64]  114.75,27.7 0 top
U9  TXS0102DCUR  [DCU]  99.95,13.8 270 top
U10  USB3320C-EZK  [QFN-32]  63.34,64.91 0 top
U11  74AVC16T245DGG  [TSSOP48]  117.3,62 180 bottom
U12  TXS0102DCUR  [DCU]  169.3,44.7 90 top
U14  74AVC16T245DGG  [TSSOP48]  81.3,62 180 bottom
U15  TXS0102DCUR  [DCU]  52.3,86 0 bottom
U16  TXS0102DCUR  [DCU]  65.3,86 0 bottom
U40  SN74LVC1G08DBVR  [SOT-23-DBV]  77.34,79.95 90 top
U$73  STANDOFF_2.8MM  [STANDOFF_2.8MM]  37.12,99.08 0 top
U$74  STANDOFF_2.8MM  [STANDOFF_2.8MM]  37.12,47.37 0 top
U$75  STANDOFF_2.8MM  [STANDOFF_2.8MM]  66.66,98.99 0 top
U$76  STANDOFF_2.8MM  [STANDOFF_2.8MM]  66.65,47.37 0 top
UART_CMD  UART3.3V  [1X05]  176.9,60.3 270 top
USB-CLIENT  MUSB-B-ST  [USB-MINIB]  37.3,34.39 0 top
USB-HOST  [MINI-USB-A]  36.05,20.36 180 top
USER  BUTTON  [TACTILE-SW]  106.54,97.9 90 top

## Tracks (layer width: path | path; a pad name or v marks a point on that pad's centre or on a via)
410_NC  (via drill 0.38, 0.41 pad 0.41)
  Top 0.152: 104.91,17.6 104.91,17.25 R122.1 | v117.18,24.18 117.36,24.18 117.85,24.68 117.85,31.6 118.24,31.99 118.24,32 118.6,32.36 118.6,33.25 U8.49 | R122.1 104.9,17.71 | v110.67,23.5 104.9,17.72 R122.1
  Bottom 0.152: v117.18,24.18 116.82,24.54 111.31,24.54 110.67,23.9 v110.67,23.5
+1.8V  (via drill 0.41)
  Top 0.406: U4.2 74.5,10.49 74.5,13.69 C46.1 74.68,13.69 74.73,13.74 v75.92,13.74 | 78.77,13.69 B11.2 77.53,13.71 v77.5,13.74
  Bottom 0.406: v75.92,13.74 v77.5,13.74
+3.3V  (via drill 0.41, 0.41 pad 0.15, 0.41 pad 0.41)
  Top 0.254: U8.12 110.52,25.95 | 120.67,23.55 120.35,23.87 U8.33 | U8.23 | 167.64,44.48 U12.V_CCB | 167.14,60.97 167.13,60.98 U3.VCC 167.02,61.82 166.96,61.87 | U8.29
  Top 0.305: 168.19,44.48 167.64,44.48 | 110.52,30.9 110.52,31.01 110.09,31.45 U8.1 | B-1.B1 B-1.B2 | 114,20.57 U8.23 | 117.01,20.87 117,20.88 U8.29 | 111.5,24.02 U8.18 111.5,19.24 v111.46,19.2
  Top 0.406: v67.04,89.97 69.88,89.97 70.06,90.14 71.13,90.14 72.55,88.72 v72.55,87.88 | v88.55,88.01 87.84,87.3 77.35,87.3 v75.75,88.9 | v92.64,85.34 v89.97,88.01 | v96.38,81.61 96.38,79.48 v96.02,79.12 | v95.49,74.85 95.66,74.68 97.09,74.68 B-1.B1 97.26,74.68 98.33,74.68 101.53,77.88 101.53,79.48 111.31,89.26 v114.33,89.26 | v127.49,96.19 130.16,98.86 EXPANSIONHEADER.2 130.34,98.86 132.11,97.08 v134.78,97.08 | v123.76,92.46 121.8,92.46 117.18,87.83 v116.47,87.83 | 166.96,61.87 166.07,61.87 | 166.07,61.87 164.65,61.87 C140.1 | C142.1 165.01,44.63 165.01,45.7 v164.83,45.7 163.05,47.47 163.05,52.82 | v101.89,37.69 100.82,37.69 R132.2 | U5.2 86.06,10.67 86.06,13.69 C48.1 86.24,13.87 87.66,13.87 | 97.26,20.09 96.91,20.09 90.69,13.87 87.66,13.87 | 97.26,20.09 98.86,20.09 R124.2 | v97.8,19.38 97.26,19.91 97.26,20.09 | R122.2 103.13,17.07 103.18,17.12 v103.18,19.2 | v86.24,27.2 86.24,17.6 87.66,16.18 87.66,13.87 | v76.11,97.87 76.11,97.16 v72.68,93.73 | v77.78,93.75 77.63,93.75 v75.75,91.87 | v96.38,32.03 96.38,28.26 R142.2 96.39,28.2 R144.2 95.96,28.2 v95.05,27.29 | 111.5,24.02 110.52,24.99 110.52,25.95 110.52,30.9 | 124.99,19.21 127.13,17.07 130.34,17.07 131.22,17.96 131.22,18.49 R133.2 131.4,18.49 138.69,18.49 140.04,19.84 140.04,22.09 144.62,26.67 v144.62,27.15 | 124.99,19.21 120.67,23.53 120.67,23.55 | 124.99,19.21 120.63,19.2 v119.87,19.2 | 114,20.57 113.77,20.34 v113.77,19.2 | v117.38,19.2 117.38,20.17 117.01,20.54 117.01,20.87 | v139.96,95.77 144.95,90.78 v147.43,90.78 | 168.19,44.48 168.71,44.48 168.94,44.7 168.94,46.93 163.05,52.82 | 163.05,52.82 163.05,57.43 164.12,58.5 164.47,58.5 C136.1 164.65,58.5 165.18,58.5 167.14,60.45 167.14,60.97
  Top 0.406: 166.07,61.87 166.07,63.09 v167.18,64.2 | v67.04,86.96 66.76,87.24 63.81,87.24 63.08,86.5 v63.08,86.32
  Bottom 0.254: 83.95,98.79 PCTS.1 | U15.V_CCB 52.52,87.13 52.51,87.12 52.83,86.81 | 65.97,88.88 65.52,88.42 U16.V_CCB 65.52,87.26 65.51,87.26 65.51,87.07 65.63,86.96 v67.04,86.96
  Bottom 0.406: C13.1 65.44,91.21 66.86,91.21 C14.1 67.04,91.03 v67.04,89.97 67.04,89.94 65.97,88.88 | v89.97,88.01 v88.55,88.01 | v96.38,81.61 v92.64,85.34 | v96.02,79.12 96.02,75.39 v95.49,74.85 | v127.49,96.19 v123.76,92.46 | v116.47,87.83 115.75,87.83 v114.33,89.26 | v119.87,19.2 v117.38,19.2 v113.77,19.2 v111.46,19.2 v103.18,19.2 97.97,19.2 v97.8,19.38 | v76.11,97.87 77.04,98.8 83.95,98.8 83.95,98.79 | v72.68,93.73 77.76,93.73 v77.78,93.75 | v75.75,91.87 v75.75,88.9 74.73,87.88 v72.55,87.88 | v96.38,32.03 101.89,37.54 v101.89,37.69 | v95.05,27.29 86.33,27.29 v86.24,27.2 | v164.83,45.7 161.16,42.02 161.16,30.8 164.53,27.42 164.53,26.44 163.79,25.7 163.79,25.69 162.78,24.69 155,24.69 152.75,22.44 149.84,22.44 145.08,27.2 144.67,27.2 v144.62,27.15 | v63.08,86.32 60.93,86.32 60.45,86.81 52.83,86.81 | v147.43,90.78 152.89,90.78 167.5,76.17 167.5,73.01 167.18,72.69 v167.18,64.2 | v134.78,97.08 138.65,97.08 v139.96,95.77
A_GND  (via drill 0.61, 0.61 pad 0.38, 0.61 pad 0.41)
  Top 0.229: 148.09,24.45 145.54,24.45
  Top 0.254: 147.05,34.1 147.51,33.63 U2.PGND | 148.29,25.43 148.29,24.66 148.09,24.45 | 145.54,24.45 145.3,24.7 C40.2 | v151.77,30.71 U2.AGND | 147.38,27.46 147.5,27.58 U2.PGND1
  Top 0.61: C37.2 145.09,40.89 146.51,40.89 D4.2 146.87,40.89 148.12,40.89 C38.2 148.47,40.89 149.72,40.89 D5.2 149.72,40.85 v149.72,38.79 149.72,38.23 149.63,38.15 149.63,37.68 149.5,37.55 | C41.1 142.07,30.23 142.07,31.65 C44.2 142.25,31.83 142.67,32.24 v143.26,32.24 | C30.2 146.16,35.92 v146.16,34.67 146.48,34.67 147.05,34.1 | C33.2 155.94,32.54 155.94,33.96 C34.1 156.12,33.96 160.03,33.96 160.21,33.78 | 160.21,33.78 159.67,33.25 159.67,32.54 B5.1 159.85,32.18 159.85,31.11 B4.1 159.67,30.94 159.67,29.52 D7.1 159.67,29.16 159.67,27.91 D6.1 159.67,27.74 158.43,27.74 | 160.21,33.78 160.38,33.96 162.34,33.96 166.07,30.23 166.07,29.34 C28.2 | AUDIO_IN.1 159.85,6.22 149,6.22 AUDIO_OUT.1 148.83,6.4 v148.83,9.6 | C40.2 145.45,25.43 | C42.2 148.29,25.43 148.29,25.62 149.17,26.49 v150.78,26.49 | 158.43,27.74 156.12,27.74 C35.2 155.94,27.38 155.94,27.03 152.56,23.65 v151.77,23.65 150.25,23.65 R41.2 150.07,23.47 150.07,20.45 C43.2 150.07,20.09 150.07,19.56 v149.54,19.02 | 158.43,27.74 v158.43,27.56 | v151.77,33.95 151.77,35.28 149.5,37.55 | 149.5,37.55 R42.1 | v147.1,27.23 147.33,27.46 147.38,27.46 | v162.72,26.49 162.23,26 C29.2
  Bottom 0.61: v148.83,9.6 148.83,18.31 v149.54,19.02 | v143.26,32.24 145.69,34.67 v146.16,34.67 149.72,38.23 v149.72,38.79 | v147.1,27.23 147.84,26.49 v150.78,26.49 151.3,26.49 151.77,26.02 | v151.77,23.65 151.77,26.02 | 151.77,26.02 v151.77,30.71 v151.77,33.95 | v158.43,27.56 159.49,26.49 v162.72,26.49
AVDD  (via drill 0.38)
  Top 0.152: 54.8,101.17 54.77,101.17 | v96.02,96.55 96.02,97.89 98.32,100.19 98.32,100.65 97.8,101.17 54.8,101.17 | LCD_PWR.5 35.14,81.51 54.8,101.17
  Bottom 0.152: v96.02,96.55 96.02,94.94 LCD1.AVDD
B_DSS_ACBIAS
  Bottom 0.152: U14.17 83.56,65.78 83.56,69.06 87.5,73 R95.2
B_DSS_DATA0
  Bottom 0.152: R48.2 117.89,76.16 117.89,75.29 112.05,69.45 U11.2
B_DSS_DATA1
  Bottom 0.152: R49.2 119.27,76.17 119.22,76.12 119.22,76.03 112.55,69.36 U11.3
B_DSS_DATA2
  Bottom 0.152: R50.2 120.22,75.29 118.95,75.29 113.55,69.88 U11.5
B_DSS_DATA3
  Bottom 0.152: R51.2 121.4,74.87 119.11,74.87 114.05,69.81 U11.6
B_DSS_DATA4
  Bottom 0.152: R52.2 124.3,75.22 123.55,74.47 119.25,74.47 114.54,69.76 114.54,66.94 115.05,66.43 U11.8
B_DSS_DATA5
  Bottom 0.152: R53.2 125.86,76.13 125.86,75.04 124.92,74.11 119.48,74.11 114.98,69.61 114.98,67.04 115.56,66.46 115.56,66.34 115.55,66.32 U11.9
B_DSS_DATA6
  Bottom 0.152: R54.2 127.49,74.37 125.41,72.29 119.04,72.29 116.21,69.46 116.21,67.09 116.58,66.73 116.58,65.81 U11.11
B_DSS_DATA7
  Bottom 0.152: R55.2 129.1,75.42 125.6,71.92 119.18,71.92 116.61,69.34 116.61,67.25 117.05,66.8 U11.12
B_DSS_DATA8  (via drill 0.38 pad 0.41)
  Top 0.152: v117.25,67.65 112.12,67.69 105.3,74.51 v105.3,74.74
  Bottom 0.152: 105.09,76.14 R56.2 105.3,75.95 v105.3,74.74 | U11.13 117.55,67.35 v117.25,67.65
B_DSS_DATA9  (via drill 0.38 pad 0.41)
  Top 0.152: v106.69,74.73 113.13,68.29 117.66,68.29 118.19,67.76 v118.19,67.65
  Bottom 0.152: R57.2 106.69,76.15 v106.69,74.73 | 118.09,67.55 v118.19,67.65 118.05,67.51 U11.14
B_DSS_DATA10  (via drill 0.38 pad 0.41)
  Top 0.152: v108.29,74.73 114.36,68.65 119.02,68.65 v119.2,68.46
  Bottom 0.152: R58.2 108.29,76.14 v108.29,74.73 | v119.2,68.46 119.2,67.2 119.04,67.04 U11.16
B_DSS_DATA11  (via drill 0.38 pad 0.41)
  Top 0.152: v119.9,67.65 120.01,67.76 120.01,68.85 119.77,69.09 115.55,69.09 v109.91,74.73
  Bottom 0.152: R59.2 109.91,76.14 v109.91,74.73 | v119.9,67.65 119.9,66.93 119.55,66.59 U11.17
B_DSS_DATA12  (via drill 0.38 pad 0.41)
  Top 0.152: v120.9,67.65 120.9,68.9 120.33,69.47 116.75,69.47 v111.49,74.73
  Bottom 0.152: R60.2 111.49,76.14 v111.49,74.73 | v120.9,67.65 120.55,67.3 U11.19
B_DSS_DATA13  (via drill 0.38 pad 0.41)
  Top 0.152: v113.11,74.73 118.04,69.8 120.75,69.8 v121.9,68.65 v121.9,68.64
  Bottom 0.152: R61.2 113.11,76.14 v113.11,74.73 | U11.20 121.05,66.8 121.9,67.65 v121.9,68.64
B_DSS_DATA14  (via drill 0.38 pad 0.41)
  Top 0.152: v114.61,74.73 119.14,70.2 121.67,70.2 122.9,68.97 v122.9,67.65
  Bottom 0.152: R62.2 114.61,76.06 v114.61,74.73 | v122.9,67.65 122.05,66.8 U11.22
B_DSS_DATA15  (via drill 0.38 pad 0.41)
  Top 0.152: v116.26,74.73 120.39,70.6 122.15,70.6 123.9,68.85 v123.9,67.65
  Bottom 0.152: R63.2 116.26,76.11 v116.26,74.73 | U11.23 122.55,66.55 122.7,66.7 123.1,66.7 123.9,67.5 v123.9,67.65
B_DSS_DATA16
  Bottom 0.152: U14.2 76.06,66.79 75.74,67.11 71.34,67.11 70.8,67.65 R46.2
B_DSS_DATA17
  Bottom 0.152: U14.3 76.59,65.81 76.59,67.26 76.28,67.56 72.75,67.56 71.55,68.77 71.55,75.13 72.3,75.89 R85.2
B_DSS_DATA18
  Bottom 0.152: U14.5 77.54,67.73 77.24,68.03 74.25,68.03 73.8,68.48 R86.2
B_DSS_DATA19
  Bottom 0.152: U14.6 78.05,68.24 77.77,68.52 75.95,68.52 75.28,69.19 75.28,73.75 75.43,73.9 75.43,75.02 75.3,75.15 R87.2
B_DSS_DATA20
  Bottom 0.152: U14.8 79.05,68.81 78.87,68.99 77.57,68.99 76.8,69.75 R88.2
B_DSS_DATA21
  Bottom 0.152: U14.9 79.55,69.27 79.37,69.44 79.05,69.44 78.3,70.2 R89.2
B_DSS_DATA22
  Bottom 0.152: R90.2 79.9,70.47 80.55,69.83 U14.11
B_DSS_DATA23
  Bottom 0.152: R91.2 81.4,70.17 81.06,69.83 U14.12
B_DSS_HSYNC
  Bottom 0.152: U14.16 83.06,65.79 83.06,69.27 86,72.2 R94.2
B_DSS_PCLK
  Bottom 0.152: R92.2 82.9,70.99 81.55,69.65 U14.13
B_DSS_VSYNC
  Bottom 0.152: R93.2 84.4,71.68 82.06,69.34 82.06,65.79 U14.14
DC_5V  (via drill 0.61, 0.61 pad 0.41, 0.61 pad 0.61)
  Top 0.152: U2.AVDD
  Top 0.254: U2.PVDD1 148,27.02 147.25,26.26 146.59,26.26 145.11,27.75 v145.11,28.33 | 148.01,33.76 U2.PVDD | U2.AVDD 144.8,30.22 | B-1.A41 94.65,54.31 v94.69,54.34
  Top 0.406: v148.01,34.27 148.01,33.76
  Top 0.61: C44.1 140.29,31.83 140.29,33.25 R44.1 140.29,33.6 v140.29,34.67 139.21,34.67 130.7,43.18 130.7,44.23 130.72,44.25 130.72,54.18 133.18,56.64 v133.18,58.32 133.18,57.71 | 148.29,22.23 148.29,23.47 C42.1 | 148.29,22.23 148.29,20.45 C43.1 | v148.12,22.23 148.29,22.23 | v132.11,59.38 132.29,59.38 135.3,62.4 v135.3,72.69 | C45.1 72.19,13.69 v72.19,12.45 72.19,10.49 U4.3 | v100.29,12.09 101.17,11.2 101.17,10.67 F2.IN | C129.1 60.99,20.8 | C129.1 61.35,20.8 62.59,20.8 C130.1 62.95,20.8 64.19,20.8 R164.2 v64.26,22.86 | v47.48,34.14 v47.48,64.72 | C129.1 61.07,20.84 60.05,20.84 53.45,14.24 48.59,14.24 48.01,14.81 48.01,15.82 48,15.82 B13.1 | C47.1 U5.3 | C47.1 82.95,13.72 82.62,14.05 v82.62,32.85 | v82.63,35.92 84.68,37.96 v92.01,37.96 | v94.69,54.34 94.67,54.33 | v143.95,30.32 144.04,30.22 144.8,30.22 | C47.1 83.81,12.51 83.88,12.45 84.79,12.45 v84.81,12.43
  Bottom 0.61: v140.29,34.67 140.29,30.05 145.45,24.89 | 145.45,24.89 v148.12,22.23 | v133.18,58.32 v132.11,59.38 | EXPANSIONHEADER.3 132.82,98.86 132.82,95.66 133.89,94.59 133.89,74.11 v135.3,72.69 | v148.01,34.27 147.18,34.27 143.95,31.04 v143.95,30.32 143.95,29.34 144.95,28.33 v145.11,28.33 144.53,28.33 143.53,27.33 143.02,27.33 145.45,24.91 145.45,24.89 | v47.48,34.14 52.98,34.14 v64.26,22.86 72.19,14.92 v72.19,12.45 83.76,12.43 v84.81,12.43 86.67,10.57 94.51,10.57 96.03,12.09 v100.29,12.09 100.77,11.61 103.18,11.61 105.12,13.55 134.11,13.55 145.45,24.89 | v92.01,37.96 92.01,49.25 93.71,50.95 93.71,53.82 94.23,54.34 v94.69,54.34 | v82.62,32.85 82.62,35.9 v82.63,35.92 | v47.48,64.72 37.67,74.52 37.67,90.04 36.05,91.67 LCD_PWR.1
DKEN
  Top 0.152: R133.1 123.15,24.95 U8.35
DN2  (via drill 0.38)
  Top 0.152: 66.68,75.21 R183.2 66.64,75.95 69.12,78.44 69.12,81.46 v64.54,86.04 | D28.2 47.94,21.18 40.19,21.18 USB-HOST.D- 40.01,21.16 33.33,21.16 32.24,22.25 32.24,59.77 v58.31,85.84
  Bottom 0.152: v58.31,85.84 58.53,85.62 64.12,85.62 v64.54,86.04
DP2  (via drill 0.38)
  Top 0.152: v68.11,76.28 68.11,75.21 R184.2 | v48.9,77.88 31.66,60.63 31.66,21.79 33,20.45 40.01,20.45 USB-HOST.D+ 40.16,20.37 45.91,20.37 47.11,19.17 D27.2
  Bottom 0.152: v48.9,77.88 48.9,76.61 53.86,71.65 67.52,71.65 68.11,72.24 v68.11,76.28
DSS_ACBIAS  (via drill 0.38, 0.38 pad 0.38)
  Top 0.152: v86.77,49.96 86.24,49.96 85.35,49.07 85.35,47.6 90.91,42.04 v93.72,42.04 | v150.07,45.7 148.83,46.94 144.56,46.94 142.2,49.3 142.2,52.48 141.28,53.37 141.28,55.66 141.47,55.81 B-2.B38 143.67,55.83 | v158.61,37.16 v155.76,40.01 | v151.49,21.16 v157,26.67 | v91.75,18.96 91.75,19.91 88.96,22.71 v88.96,32.65 | v93.03,33.47 97.26,37.69 | 97.26,37.69 v97.26,41.85 | R27.1 98.76,36.2 97.26,37.69 | v129.27,14.4 132.46,17.59 140,17.59 v140.55,18.14
  Bottom 0.152: v86.77,49.96 86.77,51.03 R113.2 | v158.61,37.16 158.61,28.8 157,27.2 v157,26.67 | v155.76,40.01 155.2,40.56 154.44,40.56 150.05,44.96 150.05,45.67 v150.07,45.7 | v88.96,32.65 92.22,32.65 v93.03,33.47 | v97.26,41.85 97.07,42.04 v93.72,42.04 | v129.27,14.4 105.06,14.4 102.91,12.26 101.24,12.26 98.75,14.74 98.75,14.76 97.58,14.76 94.97,17.37 94.28,17.37 92.69,18.96 v91.75,18.96 | v140.55,18.14 143.57,21.16 v151.49,21.16
DSS_D0  (via drill 0.38, 0.38 pad 0.41)
  Top 0.152: B-2.B11 146.28,69.31 147.23,70.26 v148.5,70.26 | v132.7,70.26 125.46,70.26 125.15,69.95 125.15,64.66 124.83,64.34 107.22,64.34 107.21,64.35 105.3,62.45 v105.3,48.95 105.3,42.1 R1.1
  Bottom 0.152: v132.7,70.26 v148.5,70.26 | v105.3,48.95 R47.2
DSS_D1  (via drill 0.38, 0.38 pad 0.41)
  Top 0.152: R2.1 106.83,48.96 v106.89,49.02 | R65.2 106.9,49.03 v106.89,49.02 | B-2.B12 146.44,68.81 147.24,69.61 149.78,69.61 arc-90 v149.79,69.6 | v106.89,49.02 106.9,49.03 | v106.89,49.02 106.89,50.15 106.88,50.16 106.88,62.59 108.01,63.72 124.86,63.72 125.51,64.36 125.51,69.47 125.66,69.62 v131.4,69.62
  Bottom 0.152: v106.89,49.02 R65.2 | v149.79,69.6 149.77,69.62 149.75,69.61 147.3,69.61 147.29,69.62 v131.4,69.62
DSS_D2  (via drill 0.38, 0.38 pad 0.41)
  Top 0.152: R3.1 108.61,48.91 v108.5,49.02 | v108.5,49.02 | B-2.B13 146.47,68.31 147.12,68.96 v148.5,68.96 | v108.5,49.02 108.48,49.05 108.48,61.98 109.62,63.12 124.9,63.12 125.86,64.08 125.86,68.8 126.03,68.96 v132.72,68.96
  Bottom 0.152: v108.5,49.02 R66.2 | v132.72,68.96 v148.5,68.96
DSS_D3  (via drill 0.38, 0.38 pad 0.41)
  Top 0.152: R4.1 109.99,48.54 | 109.99,48.54 109.99,48.9 v110.12,49.02 110.1,49.04 | B-2.B14 146.54,67.82 147.02,68.31 v149.82,68.31 | 109.99,48.54 110.12,48.67 110.12,61.92 110.75,62.56 125.47,62.56 126.22,63.31 126.22,68.16 126.37,68.31 v131.4,68.31
  Bottom 0.152: v110.12,49.02 110.12,51.13 R72.2 | v131.4,68.31 v149.82,68.31
DSS_D4  (via drill 0.38, 0.38 pad 0.41)
  Top 0.152: R6.1 111.55,48.87 v111.7,49.02 | v111.7,49.02 v111.7,49.03 | B-2.B15 146.54,67.31 146.9,67.67 v148.5,67.67 | v111.7,49.02 111.69,49.03 111.69,61.05 112.54,61.9 126.09,61.9 126.58,62.38 126.58,67.59 126.65,67.67 v132.72,67.67
  Bottom 0.152: v111.7,49.02 R73.2 | v132.72,67.67 v148.5,67.67
DSS_D5  (via drill 0.38 pad 0.41)
  Top 0.152: R7.1 113.15,48.88 v113.29,49.02 113.28,49.03 113.28,60.49 114.04,61.25 126.66,61.25 126.93,61.52 126.93,66.85 127.1,67.02 v131.43,67.02 | B-2.B16 143.85,66.83 146.54,66.83 146.72,67.02 v149.82,67.02
  Bottom 0.152: v113.29,49.02 R74.2 | v131.43,67.02 v149.82,67.02
DSS_D6  (via drill 0.38 pad 0.41)
  Top 0.152: R8.1 116.35,46.98 114.89,48.44 v114.89,49.02 114.9,49.03 114.9,60.34 115.21,60.64 126.82,60.64 127.29,61.11 127.29,66.18 127.48,66.37 v132.75,66.37 | B-2.B17 146.62,66.32 146.67,66.37 v148.52,66.37
  Bottom 0.152: v114.89,49.02 R75.2 | v132.75,66.37 v148.52,66.37
DSS_D7  (via drill 0.38 pad 0.41)
  Top 0.152: R9.1 117.95,46.79 116.49,48.25 v116.49,49.02 116.49,59.66 116.82,59.99 127.36,59.99 127.64,60.27 127.64,65.49 127.87,65.72 v131.43,65.72 | B-2.B18 146.69,65.81 146.79,65.72 v149.84,65.72
  Bottom 0.152: v116.49,49.02 R76.2 | v131.43,65.72 v149.84,65.72
DSS_D8  (via drill 0.38 pad 0.41)
  Top 0.152: R10.1 119.55,46.88 118.11,48.32 v118.11,49.02 118.13,49.05 118.13,58.94 118.4,59.21 127.59,59.21 128,59.61 128,64.87 128.2,65.08 v132.75,65.08 | B-2.B19 147.78,65.3 148.01,65.08 v148.52,65.08
  Bottom 0.152: v118.11,49.02 R77.2 | v132.75,65.08 v148.52,65.08
DSS_D9  (via drill 0.38 pad 0.41)
  Top 0.152: R11.1 121.15,46.85 119.7,48.3 v119.7,49.02 119.72,49.03 119.72,58.38 120,58.66 127.97,58.66 128.35,59.04 128.35,64.14 128.65,64.43 v131.45,64.43 | B-2.B20 147.59,64.81 147.99,64.43 v149.84,64.43
  Bottom 0.152: v119.7,49.02 R78.2 | v131.45,64.43 v149.84,64.43
DSS_D10  (via drill 0.38 pad 0.41)
  Top 0.152: R12.1 122.75,46.89 121.3,48.34 v121.3,49.02 121.3,57.52 121.72,57.94 128.33,57.94 128.71,58.32 128.71,63.49 129,63.78 v132.77,63.78 | B-2.B21 147.38,64.31 147.91,63.78 v148.55,63.78
  Bottom 0.152: v121.3,49.02 R79.2 | v132.77,63.78 v148.55,63.78
DSS_D11  (via drill 0.38 pad 0.41)
  Top 0.152: R13.1 124.35,46.99 122.91,48.44 v122.91,49.02 122.91,56.73 123.4,57.23 128.72,57.23 129.06,57.57 129.06,62.89 129.31,63.13 v131.45,63.13 | B-2.B22 147.3,63.8 147.99,63.13 v149.87,63.13
  Bottom 0.152: v122.91,49.02 R80.2 | v131.45,63.13 v149.87,63.13
DSS_D12  (via drill 0.38 pad 0.41)
  Top 0.152: B-2.B23 143.85,63.32 147.2,63.32 148.04,62.48 v148.55,62.48 | v132.77,62.48 129.72,62.48 129.42,62.18 129.42,56.95 126.07,53.59 v126.07,49.02 126.07,45.26 132.44,38.89 132.44,38 132.14,37.69 R14.1
  Bottom 0.152: v132.77,62.48 v148.55,62.48 | R81.2 126.07,51.15 v126.07,49.02
DSS_D13  (via drill 0.38 pad 0.41)
  Top 0.152: B-2.B24 147.12,62.81 148.12,61.84 v149.87,61.84 | R15.1 132.04,36.09 133.23,37.29 133.23,38.58 127.34,44.48 v127.34,49.02 127.34,54 129.78,56.44 129.78,61.54 130.07,61.84 v131.48,61.84
  Bottom 0.152: v131.48,61.84 v149.87,61.84 | 127.72,51.13 R82.2 127.34,50.79 v127.34,49.02
DSS_D14  (via drill 0.38 pad 0.41)
  Top 0.152: B-2.B25 147.02,62.31 148.14,61.19 v148.57,61.19 | R16.1 132.49,34.49 133.84,35.84 133.84,38.48 128.51,43.81 128.51,48.51 v128.51,49.02 128.51,54.1 130.13,55.73 130.13,60.83 130.49,61.19 v132.8,61.19
  Bottom 0.152: v132.8,61.19 v148.57,61.19 | R83.2 129.24,51.15 | R83.2 128.84,50.69 | v128.51,49.02 128.51,50.36 R83.2
DSS_D15  (via drill 0.38 pad 0.41)
  Top 0.152: B-2.B26 143.84,61.82 146.9,61.82 148.19,60.53 v149.87,60.53 | R17.1 132.9,32.89 134.19,34.19 134.19,38.66 129.64,43.22 129.64,47.37 v129.64,49.02 129.64,54.29 130.53,55.18 130.53,59.58 v131.48,60.53
  Bottom 0.152: v131.48,60.53 v149.87,60.53 | R84.2 130.92,51.15 | R84.2 130.54,50.79 | R84.2 129.62,49.87 129.62,49.03 v129.64,49.02
DSS_D16  (via drill 0.38 pad 0.41)
  Top 0.152: B-2.B27 146.91,61.32 148.36,59.87 v148.57,59.87 | v134.07,31.32 131.32,31.32 R18.1
  Bottom 0.152: v148.57,59.87 135.72,59.87 134.07,58.22 v134.07,31.32 | R100.2 69.2,32.04 70.81,30.43 91.77,30.43 92.78,29.41 102.78,29.41 109.95,36.59 127.46,36.59 132.72,31.32 v134.07,31.32 | v134.07,31.32 134.06,31.33
DSS_D17  (via drill 0.38, 0.38 pad 0.41)
  Top 0.152: B-2.B28 146.92,60.81 147.91,59.82 147.91,59.38 148.09,59.21 v149.87,59.21 | v134.73,29.72 134.71,29.7 R19.1 | v70.7,29.72 v70.7,32.63
  Bottom 0.152: v149.87,59.21 135.77,59.21 134.73,58.17 v134.73,29.72 133.47,29.72 127.12,36.07 110.55,36.07 103.21,28.73 92.32,28.73 91.07,29.98 70.96,29.98 v70.7,29.72 | R101.2 v70.7,32.63
DSS_D18  (via drill 0.38, 0.38 pad 0.41)
  Top 0.152: B-2.B29 143.85,60.33 146.9,60.33 147.56,59.66 147.56,58.93 147.91,58.57 v148.57,58.57 | v135.39,28.09 v135.38,28.1 R20.1 | v72.36,32.72 72.37,32.72 v72.37,28.11
  Bottom 0.152: v148.57,58.57 136.15,58.57 135.39,57.81 v135.39,28.09 | R102.2 72.36,51.15 v72.36,32.72 | v135.39,28.09 135.39,28.11 | v72.37,28.11 72.4,28.07 103.61,28.07 110.92,35.38 118.49,35.38 125.78,28.09 v135.39,28.09
DSS_D19  (via drill 0.38, 0.38 pad 0.41)
  Top 0.152: B-2.B30 143.86,59.84 146.87,59.84 147.2,59.51 147.2,58.75 148.04,57.91 v149.89,57.91 | v136.05,26.49 v136.04,26.5 R21.1 | v73.92,26.52 v73.92,32.79
  Bottom 0.152: v149.89,57.91 136.89,57.91 136.05,57.07 v136.05,26.49 134.97,27.57 125.44,27.57 118.27,34.74 111.16,34.74 102.92,26.49 73.95,26.49 v73.92,26.52 | R103.2 73.92,51.15 v73.92,32.79
DSS_D20  (via drill 0.38, 0.38 pad 0.41)
  Top 0.152: B-2.B31 146.74,59.31 146.84,59.21 146.84,58.57 148.14,57.28 v148.57,57.28 | v136.71,24.89 v136.7,24.9 R22.1 | v75.48,24.92 v75.48,32.8
  Bottom 0.152: v148.57,57.28 137.22,57.28 136.71,56.77 v136.71,24.89 | R104.2 75.48,51.15 v75.48,32.8 | v136.71,24.89 136.71,24.92 | v136.71,24.89 136.41,25.19 94.55,25.19 93.64,24.28 89.36,24.28 88.72,24.92 v75.48,24.92
DSS_D21  (via drill 0.38, 0.38 pad 0.41)
  Top 0.152: B-2.B32 146.3,58.81 146.49,58.62 146.49,58.42 148.29,56.62 v149.89,56.62 | v137.37,23.32 137.35,23.3 R23.1 | v77.16,32.77 77.13,32.77 v77.13,23.27
  Bottom 0.152: v149.89,56.62 137.6,56.62 137.37,56.39 v137.37,23.32 134.82,23.32 134.36,22.86 87.97,22.86 86.89,23.94 78.12,23.94 77.45,23.27 v77.13,23.27 | R107.2 77.16,51.15 v77.16,32.77
DSS_D22  (via drill 0.38, 0.38 pad 0.41)
  Top 0.152: B-2.B33 146.06,58.32 148.39,55.98 v148.6,55.98 | v138.03,21.69 v138.02,21.7 R24.1 | v78.73,21.83 v78.73,32.77
  Bottom 0.152: v148.6,55.98 138.72,55.98 138.03,55.3 138.03,21.83 | R108.2 78.73,51.15 v78.73,32.77 | 138.03,21.83 v138.03,21.69 | 138.03,21.83 137.64,21.44 134.69,21.44 134.3,21.83 v78.73,21.83
DSS_D23  (via drill 0.38, 0.38 pad 0.41)
  Top 0.152: B-2.B34 143.86,57.84 146.03,57.84 147.94,55.93 147.94,55.63 148.24,55.32 v149.92,55.32 | v138.67,20.09 138.66,20.1 R25.1 | v80.33,20.12 v80.33,32.82
  Bottom 0.152: R109.2 80.33,51.15 v80.33,32.82 | v80.33,20.12 138.67,20.12 v138.67,20.09 138.67,54.18 139.85,55.37 145.89,55.37 145.93,55.32 v149.92,55.32
DSS_HSYNC  (via drill 0.38, 0.38 pad 0.38)
  Top 0.152: v97.8,32.18 98.51,31.47 98.86,31.47 R28.1 | v102.78,37.16 102.78,37.87 98.57,42.08 v98.57,42.95 | v139.4,27.38 134.25,32.54 133.71,32.54 v133.36,32.18 | B-2.B36 143.67,56.72 141.02,56.72 140.62,56.35 140.62,52.63 v140.98,52.25 | v89.44,47.47 89.96,47.47 v93.81,43.62 | v142.03,26.99 143.31,28.27 v143.31,28.37
  Bottom 0.152: R112.2 85.1,50.65 C9.1 88.37,47.47 v89.44,47.47 | v97.8,32.18 v102.78,37.16 128.38,37.16 v133.36,32.18 | v142.03,26.99 140.47,25.43 139.76,25.43 139.4,25.78 v139.4,27.38 | v140.98,52.25 140.9,52.17 139.66,52.17 139.22,51.74 139.22,40.89 141.69,38.43 141.69,30.19 143.37,28.51 143.37,28.42 v143.31,28.37 | v93.81,43.62 94.48,42.95 v98.57,42.95
DSS_LCD_PON  (via drill 0.38, 0.41 pad 0.41)
  Top 0.152: v140.11,26.14 140.11,24.36 139.64,23.89 v139.64,23.44 | B-2.A12 139.22,68.81 138.16,68.81 137.42,68.07 137.42,59.74 131.52,53.84 131.52,43.62 138.2,36.94 139.43,36.94 v139.58,36.79 | v90.69,32.03 90.69,26.67 91.4,25.96 91.4,22.94 93.72,20.61 v93.72,18.96 | v112.2,15.47 111.87,15.8 98.3,15.8 v97.97,15.47
  Bottom 0.152: v112.2,15.47 133.71,15.47 137.27,19.02 138.69,19.02 139.76,20.09 139.76,23.33 arc90 v139.64,23.44 | v140.11,26.14 140.11,29.34 139.36,30.09 139.36,36.58 v139.58,36.79 | R115.2 89.97,51.03 89.97,48.54 90.58,47.93 90.58,45.41 84.46,39.29 84.46,32.42 84.92,31.97 90.62,31.97 v90.69,32.03 | v97.97,15.47 94.48,18.96 v93.72,18.96
DSS_PCLK  (via drill 0.38, 0.38 pad 0.38)
  Top 0.152: v113.8,43.38 114.51,42.67 114.51,41.96 R26.1 | v141.18,70.94 141.18,58.32 142.25,57.25 143.67,57.25 B-2.B35 | v132.82,71.48 131.76,71.48 v131.4,71.12 | v111.49,61.87 111.49,61.52 110.78,60.81 v110.78,43.38 | 84.28,48.12 v84.28,48.54 84.28,47.95 91.07,41.17 v92.87,41.17
  Bottom 0.152: R110.2 81.9,50.65 84.06,48.49 | 84.06,48.49 C7.1 | v113.8,43.38 v110.78,43.38 100.17,43.38 97.96,41.17 v92.87,41.17 | v84.28,48.54 84.11,48.54 84.06,48.49 | v141.18,70.94 141.1,70.87 133.42,70.87 132.82,71.46 v132.82,71.48 | v111.49,61.87 112.16,61.2 128.48,61.2 129.67,62.4 129.67,69.42 131.38,71.12 v131.4,71.12
DSS_VSYNC  (via drill 0.38, 0.38 pad 0.38)
  Top 0.152: R40.1 99.04,29.87 98.47,29.87 v97.76,30.58 | B-2.B37 143.82,56.3 141.16,56.3 140.95,56.12 140.95,53.17 141.62,52.53 141.62,50.66 v141.52,50.56 | v142.73,35.99 141.21,34.47 141.21,29.86 141.16,29.81 141.16,26.82 141.78,26.2 142.26,26.2 142.68,25.78 142.68,25.5 139.78,22.61 135.64,22.61 v135.43,22.39 | v93.17,30.58 93.17,31.48 90.47,34.19 v85.61,34.19 85.15,33.73 v85.15,22.55 | v90.08,43.92 86.06,47.93 v86.06,48.72
  Bottom 0.152: R111.2 83.5,50.65 C8.1 86.06,48.09 v86.06,48.72 | v141.52,50.56 139.73,48.77 139.73,41.21 142.73,38.21 v142.73,35.99 | v93.17,30.58 v97.76,30.58 | v85.61,34.19 85.62,39.38 85.62,39.46 v90.08,43.92 | v135.43,22.39 135.4,22.42 85.29,22.42 v85.15,22.55
DVDD  (via drill 0.38)
  Top 0.152: v122.16,85.88 122.69,85.88 131.53,77.04 v132.58,77.04 133.62,78.08 145.12,78.08 v147.94,80.9
  Bottom 0.152: 150.6,84.63 150.6,83.03 R810.1 150.43,82.86 148.83,81.25 R816.1 148.83,81.08 148.65,80.9 v147.94,80.9 | 150.6,84.63 152.03,84.63 R828.1 152.2,84.63 153.63,84.63 C410.1 | 150.6,84.63 C411.1 | R813.2 130.87,76.28 131.82,76.28 v132.58,77.04 | LCD1.DVDD 114.07,93.89 122.08,85.88 v122.16,85.88
DVI_CLK+
  Top 0.152: U8.57 114.51,37.27 114.65,37.41 R26.2
DVI_DATA0
  Top 0.152: U8.63 111.5,35.34 | 111.5,35.34 | R1.2 105.12,40.23 105.12,38.42 107.87,35.67 111.17,35.67 111.5,35.34
DVI_DATA1
  Top 0.152: R2.2 106.83,37.5 107.96,36.37 111.36,36.37 112,35.74 U8.62
DVI_DATA2
  Top 0.152: R3.2 108.61,37.37 109.02,36.96 111.64,36.96 112.5,36.09 U8.61
DVI_DATA3
  Top 0.152: R4.2 109.99,37.84 110.31,37.53 111.87,37.53 113,36.4 U8.60
DVI_DATA4
  Top 0.152: R6.2 111.55,38.67 113.51,36.72 U8.59
DVI_DATA5
  Top 0.152: R7.2 113.15,38.22 113.99,37.38 U8.58
DVI_DATA6
  Top 0.152: U8.55 115.53,33.33 115.53,36.54 116.35,37.36 R8.2
DVI_DATA7
  Top 0.152: U8.54 116.01,36.23 117.95,38.17 R9.2
DVI_DATA8
  Top 0.152: U8.53 116.48,33.32 116.48,35.97 119.55,39.04 R10.2
DVI_DATA9
  Top 0.152: U8.52 | U8.52 117,35.87 119.77,38.63 120.76,38.63 121.15,39.02 R11.2
DVI_DATA10
  Top 0.152: U8.51 117.5,35.62 120.09,38.2 122.3,38.2 122.75,38.66 R12.2
DVI_DATA11
  Top 0.152: U8.50 118,35.45 120.36,37.81 123.76,37.81 124.35,38.4 R13.2
DVI_DATA12
  Top 0.152: R14.2 126.85,37.7 122.37,33.22 122.37,31.77 121.56,30.96 120.36,30.96 U8.47
DVI_DATA13
  Top 0.152: R15.2 125.95,36.1 122.88,33.03 122.88,31.65 121.67,30.44 U8.46
DVI_DATA14
  Top 0.152: R16.2 125.16,34.5 123.52,32.85 123.52,31.56 121.89,29.93 120.37,29.93 U8.45
DVI_DATA15
  Top 0.152: R17.2 125.59,32.9 122.18,29.49 120.39,29.49 U8.44
DVI_DATA16
  Top 0.152: R18.2 124.82,31.3 122.46,28.94 U8.43
DVI_DATA17
  Top 0.152: R19.2 124.14,29.7 122.91,28.46 120.36,28.46 U8.42
DVI_DATA18
  Top 0.152: R20.2 129.45,27.95 U8.41
DVI_DATA19
  Top 0.152: R21.2 128.65,27.45 U8.40
DVI_DATA20
  Top 0.152: R22.2 128.66,24.9 126.61,26.95 U8.39
DVI_DATA21
  Top 0.152: R23.2 128.94,23.3 125.8,26.44 U8.38
DVI_DATA22
  Top 0.152: R24.2 129.09,21.7 124.83,25.96 U8.37
DVI_DATA23
  Top 0.152: R25.2 128.76,20.1 123.41,25.45 U8.36
DVI_DEN
  Top 0.152: U8.2 107.19,30.95 101.95,36.2 R27.2
DVI_DSEL
  Top 0.152: U8.14 109.13,24.97 107.07,24.97 103.9,21.8 R143.1
DVI_HSYNC
  Top 0.152: U8.4 106.61,29.95 105.15,31.41 R28.2
DVI_MSEN
  Top 0.152: U8.11 106.92,26.45 105.46,25 R131.1
DVI_NDISABLE  (via drill 0.38, 0.38 pad 0.38)
  Top 0.152: v97.8,21.16 97.8,22.94 97.09,23.65 97.09,24.54 99.04,26.49 R43.1 | v91.75,20.98 91.75,21.51 89.97,23.29 89.97,33.33 v90.06,33.41 | v136.91,73.43 136.91,70.59 138.16,69.34 139.22,69.34 B-2.A11 | v134.78,75.56 134.42,75.56 v131.4,72.54 | v92.04,35.41 92.93,35.41 94.85,37.33 94.85,43.66 v88.55,49.96